# Altium schematic sheet AVRDevBoard.SchDoc
size A4
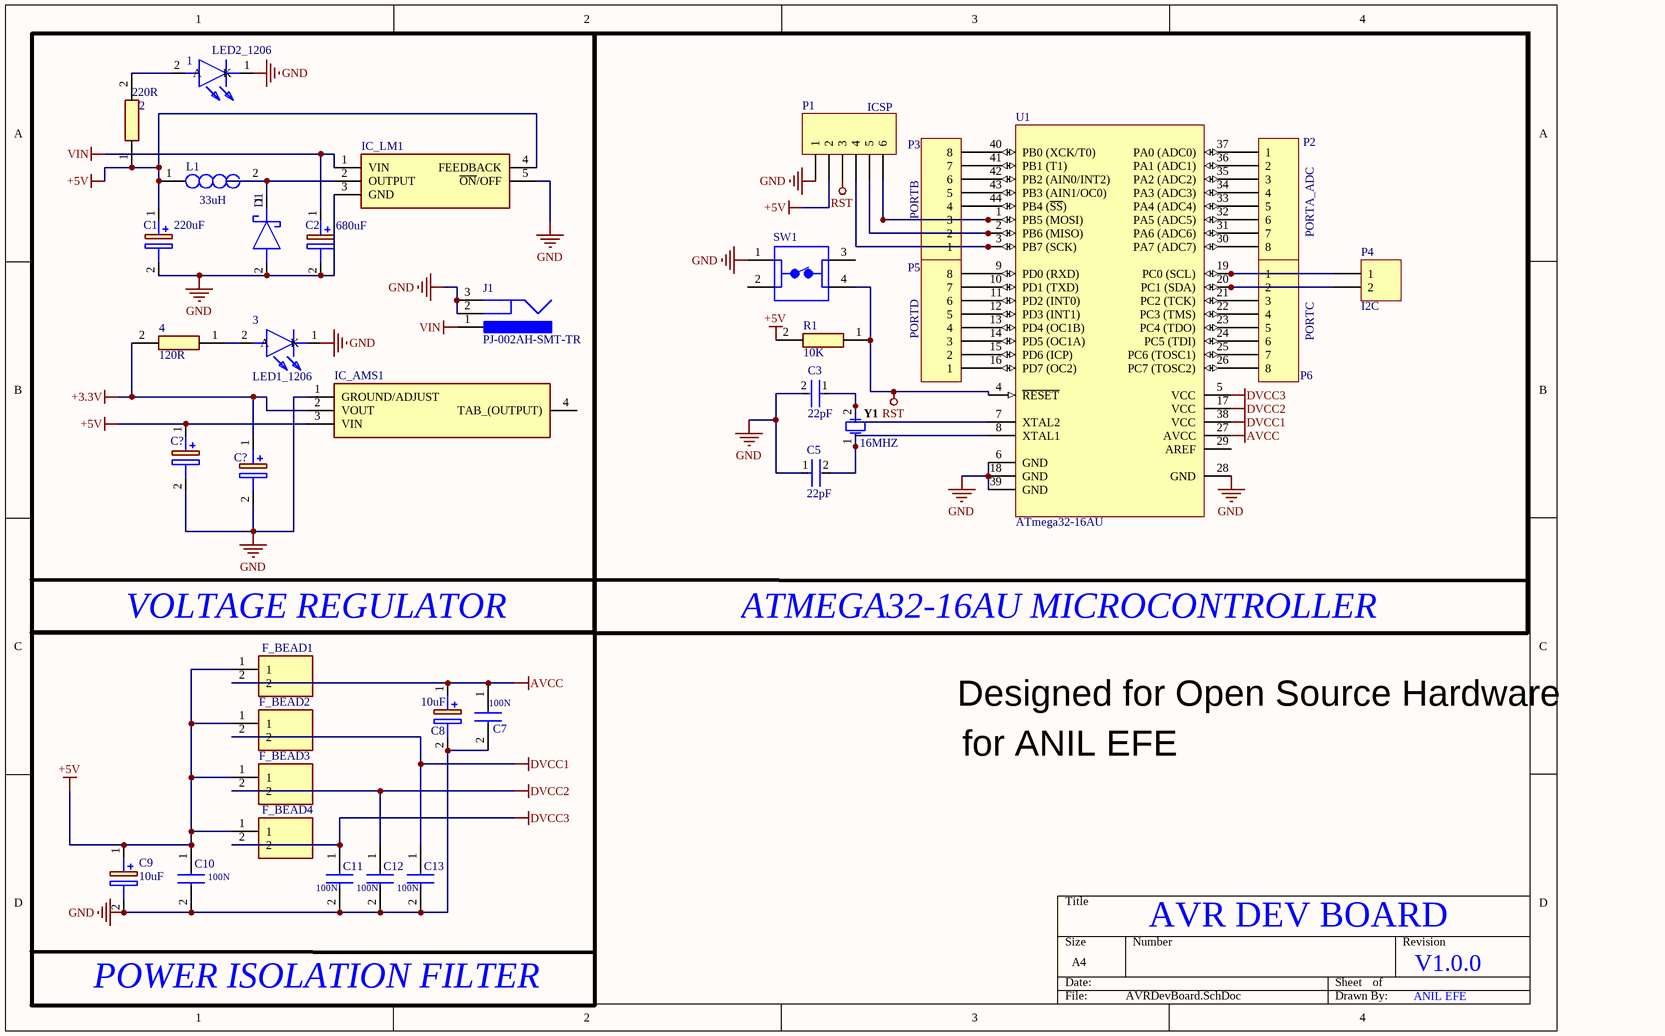
[diagram p0: AVRDevBoard.SchDoc]

## Parts
1  LED2_1206  [LEDC3216X130N]
2  220R  [RESC3216X70N]
3  LED1_1206  [LEDC3216X130N]
4  120R  [RESC3216X70N]
C1  220uF  [CAPPRD500W65D1250H2200]
C2  680uF  [CAPPRD500W60D1275H2200]
C3  22pF  [FP-C1206C-EB-MFG]
C4  C?  [CAPPM3528X210N]
C5  22pF  [FP-C1206C-EB-MFG]
C6  C?  [CAPPM3528X210N]
C7  100N  [CAPC3216X100N]
C8  10uF  [CAPPRD200W50D525H1250]
C9  10uF  [CAPPRD200W50D525H1250]
C10  100N  [CAPC3216X100N]
C11  100N  [CAPC3216X100N]
C12  100N  [CAPC3216X100N]
C13  100N  [CAPC3216X100N]
D1  (no value)  [SODFL4725X110N]
F_BEAD1  (no value)  [BEADC3216X180N]
F_BEAD2  (no value)  [BEADC3216X180N]
F_BEAD3  (no value)  [BEADC3216X180N]
F_BEAD4  (no value)  [BEADC3216X180N]
IC_AMS1  (no value)  [SOT229P700X180-4N]
IC_LM1  (no value)  [TO170P470X1028X2142-5P]
J1  PJ-002AH-SMT-TR  [CUI-PJ-002AH-4_V]
L1  33uH  [INDPM6063X300N]
P1  ICSP  [HDR1X6]
P2  PORTA_ADC  [HDR1X8]
P3  PORTB  [HDR1X8]
P4  I2C  [HDR1X2]
P5  PORTD  [HDR1X8]
P6  PORTC  [HDR1X8]
R1  10K  [RESC3216X70N]
SW1  (no value)  [TE_3-1825910-1]
U1  ATmega32-16AU  [44A_N]
Y1  16MHZ  [FOX-FOXSLF160-20]

## Blocks framed on the sheet
VOLTAGE REGULATOR: 1-4 C1 C2 C4 C6 D1 IC_AMS1 IC_LM1 J1 L1
ATMEGA32-16AU MICROCONTROLLER: C3 C5 P1-P6 R1 SW1 U1 Y1

## Nets
+3.3V: 4.2 C6.1(+) IC_AMS1.2(VOUT)
+5V: 2.1 C1.1(+) C4.1(+) C9.1(+) C10.1 F_BEAD1.1 F_BEAD2.1 F_BEAD3.1 F_BEAD4.1 IC_AMS1.3(VIN) IC_LM1.4(FEEDBACK) L1.1 P1.2 R1.2
AVCC: C7.1 C8.1(+) F_BEAD1.2 U1.27(AVCC)
DVCC1: C13.1 F_BEAD2.2 U1.38(VCC)
DVCC2: C12.1 F_BEAD3.2 U1.17(VCC)
DVCC3: C11.1 F_BEAD4.2 U1.5(VCC)
GND: 1.1(K) 3.1(K) C1.2(-) C2.2(-) C3.2 C4.2(-) C5.1 C6.2(-) C7.2 C8.2(-) C9.2(-) C10.2 C11.2 C12.2 C13.2 D1.2(A) IC_AMS1.1(GROUND/ADJUST) IC_LM1.3(GND) IC_LM1.5(~{ON}/OFF) J1.2 J1.3 P1.1 SW1.1 U1.6(GND) U1.18(GND) U1.28(GND) U1.39(GND)
RST: P1.3 R1.1 SW1.4 U1.4(~{RESET})
VIN: C2.1(+) IC_LM1.1(VIN) J1.1
Net1_2: 1.2(A) 2.2
Net3_2: 3.2(A) 4.1
NetC3_1: C3.1 U1.7(XTAL2) Y1.2
NetC5_2: C5.2 U1.8(XTAL1) Y1.1
NetD1_1: D1.1(K) IC_LM1.2(OUTPUT) L1.2
NetP1_4: P1.4 P3.1 U1.3(PB7_(SCK))
NetP1_5: P1.5 P3.2 U1.2(PB6_(MISO))
NetP1_6: P1.6 P3.3 U1.1(PB5_(MOSI))
NetP2_1: P2.1 U1.37(PA0_(ADC0))
NetP2_2: P2.2 U1.36(PA1_(ADC1))
NetP2_3: P2.3 U1.35(PA2_(ADC2))
NetP2_4: P2.4 U1.34(PA3_(ADC3))
NetP2_5: P2.5 U1.33(PA4_(ADC4))
NetP2_6: P2.6 U1.32(PA5_(ADC5))
NetP2_7: P2.7 U1.31(PA6_(ADC6))
NetP2_8: P2.8 U1.30(PA7_(ADC7))
NetP3_4: P3.4 U1.44(PB4_(~{SS}))
NetP3_5: P3.5 U1.43(PB3_(AIN1/OC0))
NetP3_6: P3.6 U1.42(PB2_(AIN0/INT2))
NetP3_7: P3.7 U1.41(PB1_(T1))
NetP3_8: P3.8 U1.40(PB0_(XCK/T0))
NetP4_1: P4.1 P6.1 U1.19(PC0_(SCL))
NetP4_2: P4.2 P6.2 U1.20(PC1_(SDA))
NetP5_1: P5.1 U1.16(PD7_(OC2))
NetP5_2: P5.2 U1.15(PD6_(ICP))
NetP5_3: P5.3 U1.14(PD5_(OC1A))
NetP5_4: P5.4 U1.13(PD4_(OC1B))
NetP5_5: P5.5 U1.12(PD3_(INT1))
NetP5_6: P5.6 U1.11(PD2_(INT0))
NetP5_7: P5.7 U1.10(PD1_(TXD))
NetP5_8: P5.8 U1.9(PD0_(RXD))
NetP6_3: P6.3 U1.21(PC2_(TCK))
NetP6_4: P6.4 U1.22(PC3_(TMS))
NetP6_5: P6.5 U1.23(PC4_(TDO))
NetP6_6: P6.6 U1.24(PC5_(TDI))
NetP6_7: P6.7 U1.25(PC6_(TOSC1))
NetP6_8: P6.8 U1.26(PC7_(TOSC2))

Not connected (* = marked no-connect by the designer): IC_AMS1 4(TAB_(OUTPUT)); SW1 2 3; U1 29(AREF)

## Notes on the sheet
- Designed for Open Source Hardware
- for ANIL EFE
- AVR DEV BOARD
- V1.0.0
- POWER ISOLATION FILTER
- ANIL EFE

## Library data of the parts
1 3 = QTLP650C2TR: LED; Manufacturer_Name: Everlight; Datasheet Link: https://media.digikey.com/pdf/Data%20Sheets/Everlight%20PDFs/QTLP650(C,D)-2,3,4,7,B.pdf; Height: 1.3mm; Manufacturer_Part_Number: QTLP650C2TR; Mouser Part Number: 638-QTLP650C2; Mouser Price/Stock: https://www.mouser.com/Search/Refine.aspx?Keyword=638-QTLP650C2
2 4 R1 = ERJ-U08F2200V: Resistor; Manufacturer_Name: Panasonic; Datasheet Link: http://uk.rs-online.com/web/p/products/1724351; Height: 0.7mm; Manufacturer_Part_Number: ERJ-U08F2200V; Mouser Part Number: 667-ERJ-U08F2200V; Mouser Price/Stock: https://www.mouser.com/Search/Refine.aspx?Keyword=667-ERJ-U08F2200V
C1 = EEU-FC1J221S: Capacitor Polarised; Manufacturer_Name: Panasonic; Datasheet Link: http://uk.rs-online.com/web/p/products/6283835; Height: 22mm; Manufacturer_Part_Number: EEU-FC1J221S; Mouser Part Number: 667-EEU-FC1J221S; Mouser Price/Stock: https://www.mouser.com/Search/Refine.aspx?Keyword=667-EEU-FC1J221S
C2 = UPW1V681MHD: Capacitor Polarised; Manufacturer_Name: Nichicon; Allied_Number: 70187400; Datasheet Link: http://nichicon-us.com/english/products/pdfs/e-upw.pdf; Height: 22mm; Manufacturer_Part_Number: UPW1V681MHD; Mouser Part Number: 647-UPW1V681MHD; Mouser Price/Stock: https://www.mouser.com/Search/Refine.aspx?Keyword=647-UPW1V681MHD; RS Part Number: 7152776P; RS Price/Stock: http://uk.rs-online.com/web/p/products/7152776P; Allied Price/Stock: https://www.alliedelec.com/nichicon-upw1v681mhd/70187400/
C3 C5 = CMP-03020-001476-1: 1206 22pF Ceramic Multilayer Capacitor; 50VDC; 125degC; C0G Dielec; +/-5% SMD; Manufacturer Part Number: C1206C220J5GACTU; Manufacturer: KEMET; Automotive Grade: Grade 0; Temperature Coefficient: 15%; Tolerance: 0.05; Voltage Rating: 50 V; Height: 0.88mm; Mouser Description: 1206 22pF Ceramic Multilayer Capacitor; 50VDC; 125degC; C0G Dielec; +/-5% SMD; Ipc Land Pattern Name: CAPC320160X78; Temperature Range High: +150°C; Automotive: Yes; Device Class L3: Ceramic Capacitors; ComponentLink2Description: Datasheet; Temperature: -55°C to +150°C; Lead Free: Yes; Category: Cap; Device Class L2: Capacitors; Device Class L1: Passive Components; Value: 22 pF; Capacitance: 22 pF; Digikey Description: 1206 22pF Ceramic Multilayer Capacitor; 50VDC; 125degC; C0G Dielec; +/-5% SMD; Octopart: https://octopart.com/c1206c220j5gactu-kemet-131912; Material: Ceramic; Temperature Characteristic: C0G; Package: C1206C-EB; RoHS: TRUE; ComponentLink2URL: https://content.kemet.com/datasheets/KEM_C1007_X8R_ULTRA_150C_SMD.pdf; Temperature Range Low: -55°C
C4 C6 = TAJB106M025RNJ: Capacitor Polarised; Manufacturer_Name: AVX; Datasheet Link: http://datasheets.avx.com/TAJ.pdf; Height: 2.1mm; Manufacturer_Part_Number: TAJB106M025RNJ; Mouser Part Number: 581-TAJB106M025RNJ; Mouser Price/Stock: https://www.mouser.com/Search/Refine.aspx?Keyword=581-TAJB106M025RNJ
C7 C10-C13 = CL31B104KBCNNNC: Capacitor; Manufacturer_Name: Samsung Electro-Mechanics; Datasheet Link: http://www.samsungsem.com/kr/support/product-search/mlcc/CL31B104KBCNNNC.jsp; Height: 1mm; Manufacturer_Part_Number: CL31B104KBCNNNC; RS Part Number: 7666947; RS Price/Stock: http://uk.rs-online.com/web/p/products/7666947
C8 C9 = UHE1H100MDD1TD: Capacitor Polarised; Manufacturer_Name: Nichicon; Datasheet Link: http://nichicon-us.com/english/products/pdfs/e-uhe.pdf; Height: 12.5mm; Manufacturer_Part_Number: UHE1H100MDD1TD; Mouser Part Number: 647-UHE1H100MDD1TD; Mouser Price/Stock: https://www.mouser.com/Search/Refine.aspx?Keyword=647-UHE1H100MDD1TD
D1 = VSS8D5M10-M3_H: Schottky Diode; Manufacturer_Name: Vishay; Manufacturer_Part_Number: VSS8D5M10-M3/H; Datasheet Link: https://componentsearchengine.com/Datasheets/1/VSS8D5M10-M3_H.pdf; Height: 1.1mm; Mouser Part Number: 78-VSS8D5M10-M3/H; Mouser Price/Stock: https://www.mouser.com/Search/Refine.aspx?Keyword=78-VSS8D5M10-M3%2FH
F_BEAD1-F_BEAD4 = BLM31KN601BH1L: Filter; Manufacturer_Name: Murata Electronics; Datasheet Link: https://www.murata.com/en-us/products/productdetail?partno=BLM31KN601BH1%23; Height: 1.8mm; Manufacturer_Part_Number: BLM31KN601BH1L; Mouser Part Number: 81-BLM31KN601BH1L; Mouser Price/Stock: https://www.mouser.com/Search/Refine.aspx?Keyword=81-BLM31KN601BH1L
IC_AMS1 = ams1117-3.3v: Integrated Circuit; Manufacturer_Name: Advanced Monolithic Systems; Datasheet Link: http://www.advanced-monolithic.com/pdf/ds1117.pdf; Height: 1.8mm; Manufacturer_Part_Number: ams1117-3.3v
IC_LM1 = LM2596T-5.0: Integrated Circuit; Manufacturer_Name: Texas Instruments; Datasheet Link: http://www.ti.com/general/docs/lit/getliterature.tsp?genericPartNumber=lm2596&fileType=pdf; Height: 4.7mm; Manufacturer_Part_Number: LM2596T-5.0; Mouser Part Number: 926-LM2596T-50; Mouser Price/Stock: https://www.mouser.com/Search/Refine.aspx?Keyword=926-LM2596T-50; RS Part Number: 3313242; RS Price/Stock: http://uk.rs-online.com/web/p/products/3313242
J1 = CMP-2000-06896-1: DC Power Jack, Right Angle, -25 to 85 degC, 4-Pin 14.8 x 9 x 11 mm SMD, RoHS, Tape and Reel; Manufacturer: CUIInc.; Current Rating: 5A; Voltage Rating: 24V; Outside Contact Diameter: 6.5mm; Inside Contact Diameter: 2mm; Insulation Resistance: 100MOhms; Brand: CUI; Contact Plating: Nickel; Contact Gender: Male; Datasheet URL: http://www.cui.com/product/resource/pj-002ah-smt.pdf; Mounting Style: SMD/SMT; Mounting Technology: SurfaceMount; Operating Temperature Range: -25Cto+85C; Flammability Rating: UL94V-0; Mounting Angle: Right; Packaging: Reel; Connector Type: DCPowerJack; Product Category: DCPowerConnectors; Package Description: 4-Pin Surface Mount Device, Body 14.8 x 9 mm, Pitch 6.1 mm; Factory Pack Quantity: 350; Datasheet Version: Rev. 1.03, 11/2012; Contact Material: Brass; Package Reference: PJ-002AH; Housing Material: Polyamide(PA); PartNumber: PJ-002AH; Manufacturer URL: http://www.cui.com/; Product: Jacks; RoHS: True; Termination Style: SMD/SMT
L1 = B82462G4333M000: Inductor; Manufacturer_Name: EPCOS; Datasheet Link: https://en.tdk.eu/inf/30/db/ind_2008/b82462g4.pdf; Height: 3mm; Manufacturer_Part_Number: B82462G4333M000; Mouser Part Number: 871-B82462G4333M; Mouser Price/Stock: https://www.mouser.com/Search/Refine.aspx?Keyword=871-B82462G4333M; RS Part Number: 4958161P; RS Price/Stock: http://uk.rs-online.com/web/p/products/4958161P
P1 = Header 6: Header, 6-Pin; LatestRevisionDate: 17-Jul-2002; LatestRevisionNote: Re-released for DXP Platform.; Publisher: Altium Limited
P2 P3 P5 P6 = Header 8: Header, 8-Pin; LatestRevisionDate: 17-Jul-2002; LatestRevisionNote: Re-released for DXP Platform.; Publisher: Altium Limited
P4 = Header 2: Header, 2-Pin; LatestRevisionDate: 17-Jul-2002; LatestRevisionNote: Re-released for DXP Platform.; Publisher: Altium Limited
SW1 = 3-1825910-1: Switch Push Button OFF _ON_ SPST Round Button 0.05A 24VDC Momentary Contact PC Pins Thru-Hole; MF: TE Connectivity; Availability: Unavailable; SnapEDA_Link: https://www.snapeda.com/parts/3-1825910-1/TE%20Connectivity%20ALCOSWITCH%20Switches/view-part/452461/?ref=snap; Price: None; EU_RoHS_Compliance: Compliant; Package: None; TE_purchase_URL: https://www.te.com/usa-en/product-3-1825910-1.html?te_bu=Cor&te_type=disp&te_campaign=seda_glo_cor-seda-global-disp-prtnr-fy19-seda-model-bom-cta_sma-317_1&elqCampaignId=32493; MP: 3-1825910-1; Value: *
U1 = CMP-0095-00554-1: 8-bit AVR Microcontroller, 4.5-5.5V, 16MHz, 32KB Flash, 1024 Bytes EEPROM, 2KB SRAM, 44-pin TQFP, Industrial Grade (-40°C to 85°C); ComponentLink1URL: http://www.atmel.com/; Code_JEDEC: MS-026-ACB; PackageDescription: 44-Pin Plastic Thin Profile Quad Flat Pack, 10 x 10 x 1.0 mm Body, 0.8 mm Pitch (TQFP); ComponentLink2Description: ATmega32(L) Datasheet; ComponentLink3URL: http://atmel.com/dyn/resources/prod_documents/2503S.pdf; PackageVersion: revC, Oct-2010; ComponentLink1Description: Manufacturer URL; ComponentLink3Description: ATmega32(L) Summary; ComponentLink2URL: http://atmel.com/dyn/resources/prod_documents/doc2503.pdf; PackageReference: 44A; DatasheetVersion: revQ, Feb-2011
Y1 = CMP-1749-00003-1: Resistance Weld Thru-Hole Crystal, 16 MHz, -20 to 70 degC, 2-Pin THD, RoHS, Bulk; Voltage Rating: 250 V; Tolerance: 1%; Resistance: 221 kohm; Case\Package: Axial; Power Rating: 250 mW; RoHSCompliant: true; Package Quantity: 200; Packaging: Bulk; Min Operating Temperature: -55 degC; DatasheetVersion: Mar-15; ComponentLink1URL: http://www.foxonline.com/; Max Operating Temperature: 155 degC; PackageReference: FOXSLF160-20; Mount: Through Hole; PackageDescription: 2-Pin Through Hole Device, Body 11.35 x 4.65 mm; ComponentLink1Description: Manufacturer URL; ComponentLink2URL: http://www.foxonline.com/pdfs/hc49slf.pdf; ComponentLink2Description: Datasheet; Length: 0.248 inch